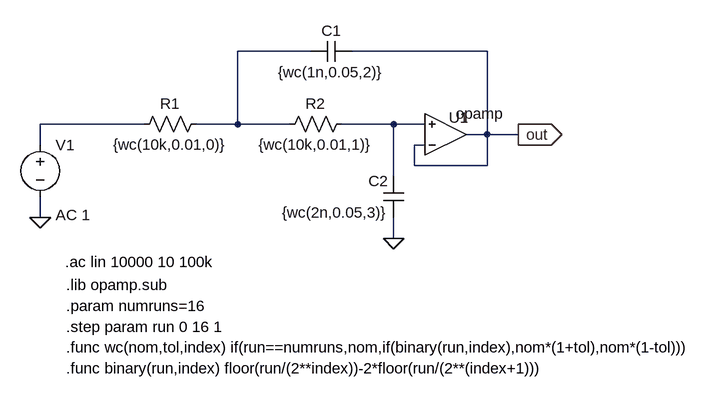
[diagram p0: schematic ltspice_model.asc]
ltspice_model.asc, the LTspice schematic file:
Version 4
SHEET 1 1288 680
WIRE -16 0 -128 0
WIRE 256 0 48 0
WIRE -272 112 -432 112
WIRE -128 112 -128 0
WIRE -128 112 -192 112
WIRE -48 112 -128 112
WIRE 112 112 32 112
WIRE 160 112 112 112
WIRE 256 128 256 0
WIRE 256 128 224 128
WIRE 304 128 256 128
WIRE -432 144 -432 112
WIRE 160 144 144 144
WIRE 144 176 144 144
WIRE 256 176 256 128
WIRE 256 176 144 176
WIRE 112 192 112 112
WIRE -432 256 -432 224
WIRE 112 288 112 256
FLAG 112 288 0
FLAG 304 128 out
IOPIN 304 128 Out
FLAG -432 256 0
SYMBOL Opamps\\opamp 192 192 M180
WINDOW 0 5 90 Left 2
SYMATTR InstName U1
SYMBOL res -176 96 R90
WINDOW 0 0 56 VBottom 2
WINDOW 3 32 56 VTop 2
SYMATTR InstName R1
SYMATTR Value {wc(10k,0.01,0)}
SYMBOL res 48 96 R90
WINDOW 0 0 56 VBottom 2
WINDOW 3 32 56 VTop 2
SYMATTR InstName R2
SYMATTR Value {wc(10k,0.01,1)}
SYMBOL cap 48 -16 R90
WINDOW 0 0 32 VBottom 2
WINDOW 3 32 32 VTop 2
SYMATTR InstName C1
SYMATTR Value {wc(1n,0.05,2)}
SYMBOL cap 128 256 R180
WINDOW 0 24 56 Left 2
WINDOW 3 24 8 Left 2
SYMATTR InstName C2
SYMATTR Value {wc(2n,0.05,3)}
SYMBOL voltage -432 128 R0
WINDOW 123 24 124 Left 2
WINDOW 39 0 0 Left 0
SYMATTR InstName V1
SYMATTR Value ""
SYMATTR Value2 AC 1
TEXT -392 456 Left 2 !.func wc(nom,tol,index) if(run==numruns,nom,if(binary(run,index),nom*(1+tol),nom*(1-tol)))
TEXT -392 488 Left 2 !.func binary(run,index) floor(run/(2**index))-2*floor(run/(2**(index+1)))
TEXT -392 424 Left 2 !.step param run 0 16 1
TEXT -392 392 Left 2 !.param numruns=16
TEXT -394 324 Left 2 !.ac lin 10000 10 100k
TEXT -392 360 Left 2 !.lib opamp.sub

The netlist it stands for:
* ltspice_model.asc
XU1 out N003 out opamp Aol=100K GBW=10Meg  ; pins invin noninvin out
R1 N001 N002 {wc(10k,0.01,0)}
R2 N003 N001 {wc(10k,0.01,1)}
C1 out N001 {wc(1n,0.05,2)}
C2 0 N003 {wc(2n,0.05,3)}
V1 N002 0 AC 1
.func wc(nom,tol,index) if(run==numruns,nom,if(binary(run,index),nom*(1+tol),nom*(1-tol)))
.func binary(run,index) floor(run/(2**index))-2*floor(run/(2**(index+1)))
.step param run 0 16 1
.param numruns=16
.ac lin 10000 10 100k
.lib opamp.sub
.backanno
.end